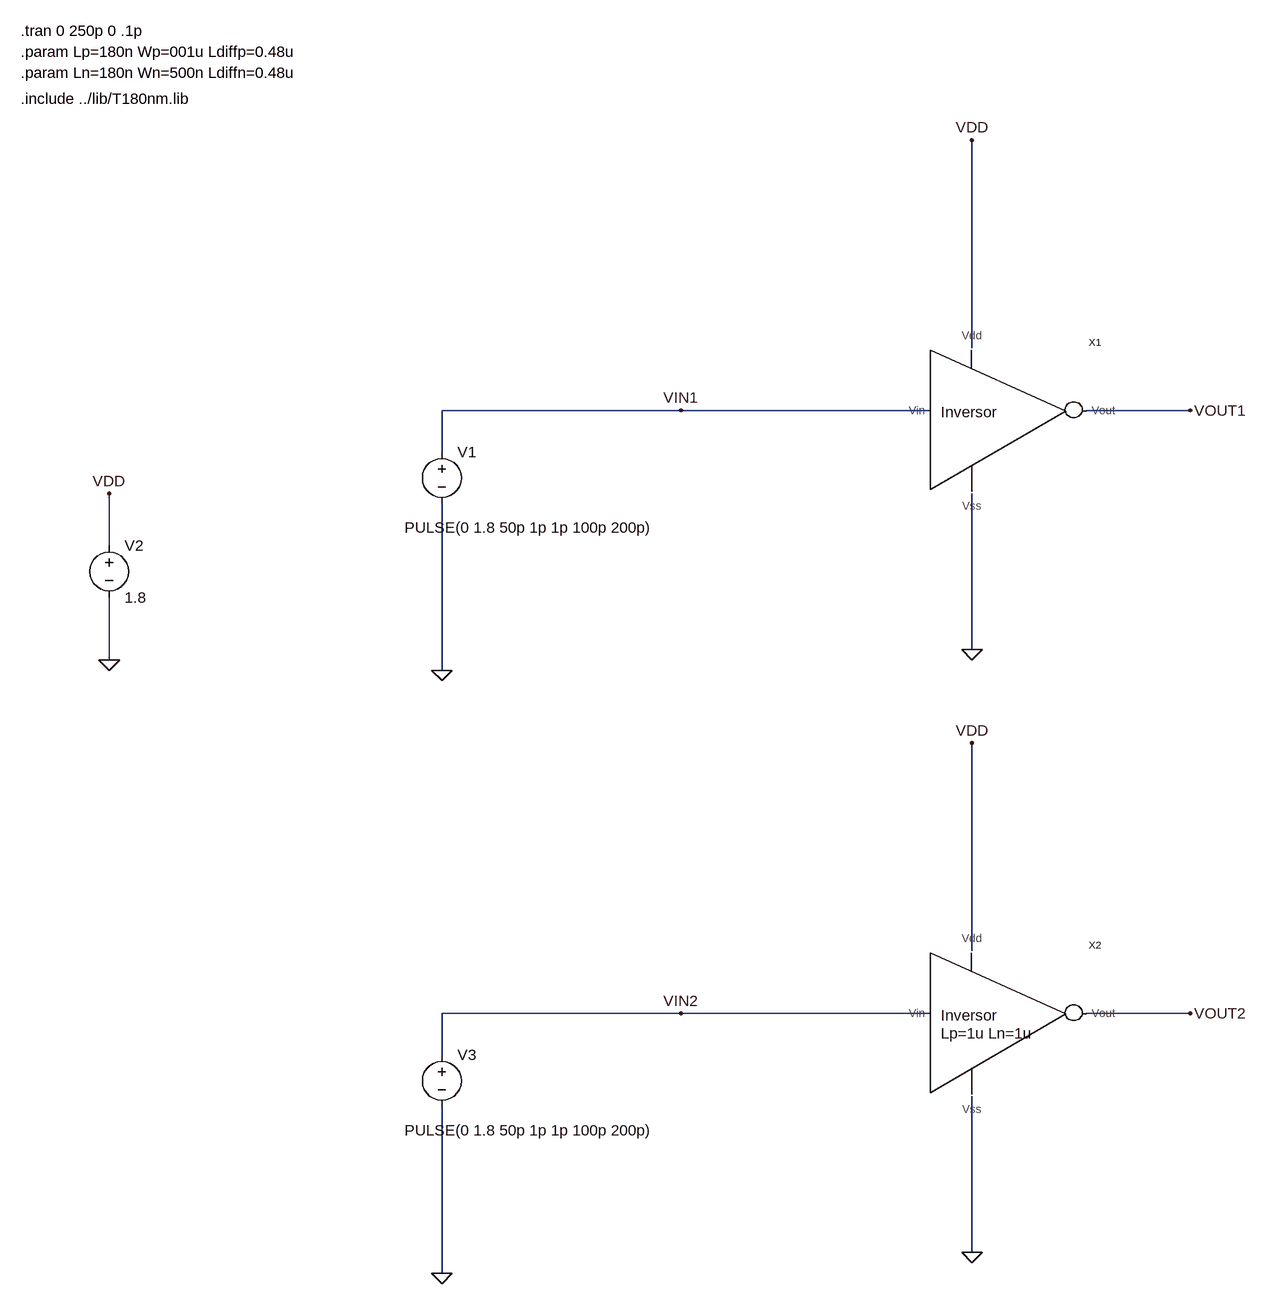
[diagram p0: schematic inversor_tb.asc]
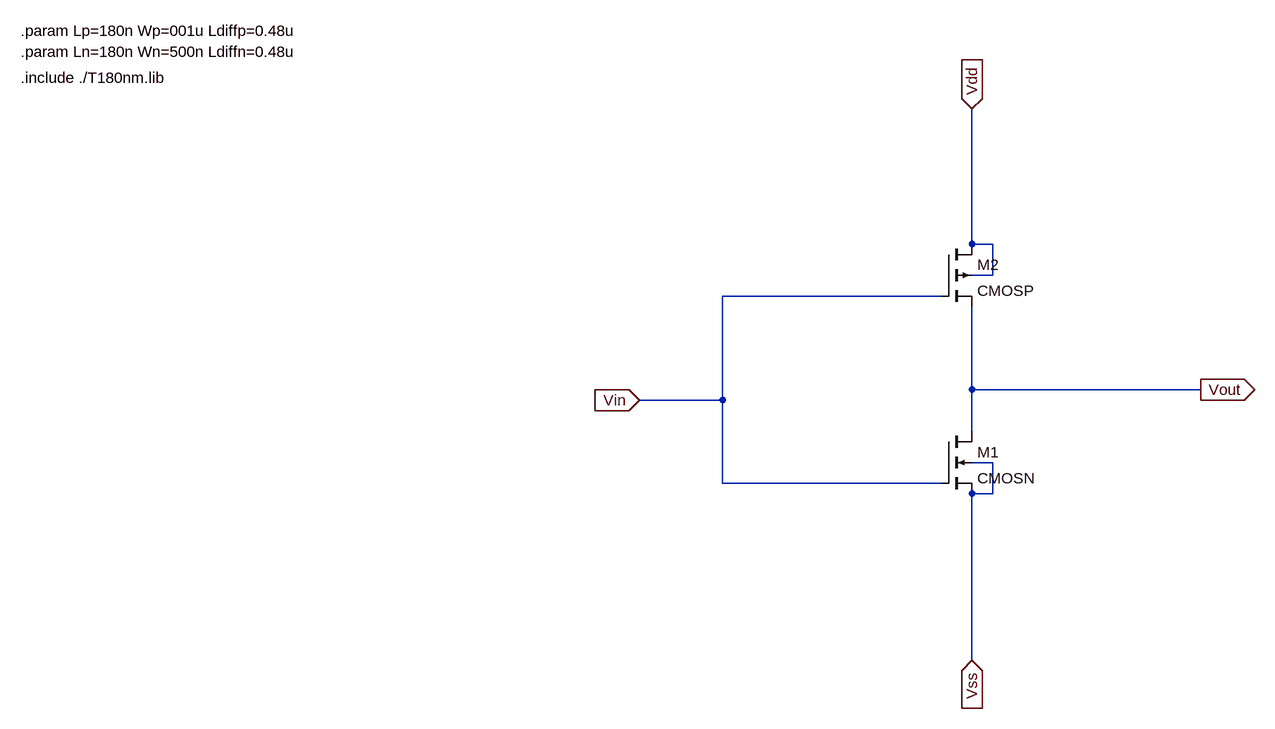
[diagram p1: sub-circuit inversor.asc]
inversor_tb.asc, the LTspice schematic file:
Version 4
SHEET 1 880 1476
WIRE 224 32 224 -288
WIRE -224 128 -592 128
WIRE 160 128 -224 128
WIRE 560 128 400 128
WIRE -592 192 -592 128
WIRE -1104 336 -1104 256
WIRE 224 496 224 256
WIRE -1104 512 -1104 416
WIRE -592 528 -592 272
WIRE 224 960 224 640
WIRE -224 1056 -592 1056
WIRE 160 1056 -224 1056
WIRE 560 1056 400 1056
WIRE -592 1120 -592 1056
WIRE 224 1424 224 1184
WIRE -592 1456 -592 1200
FLAG 224 496 0
FLAG 224 -288 VDD
FLAG 560 128 VOUT1
FLAG -224 128 VIN1
FLAG -1104 512 0
FLAG -592 528 0
FLAG -1104 256 VDD
FLAG 224 1424 0
FLAG 224 640 VDD
FLAG 560 1056 VOUT2
FLAG -224 1056 VIN2
FLAG -592 1456 0
SYMBOL voltage -592 176 R0
WINDOW 3 -57 132 Left 2
WINDOW 123 0 0 Left 2
WINDOW 39 0 0 Left 2
SYMATTR Value PULSE(0 1.8 50p 1p 1p 100p 200p)
SYMATTR InstName V1
SYMBOL voltage -1104 320 R0
WINDOW 123 0 0 Left 2
WINDOW 39 0 0 Left 2
SYMATTR InstName V2
SYMATTR Value 1.8
SYMBOL inversor 224 128 R0
SYMATTR InstName X1
SYMBOL voltage -592 1104 R0
WINDOW 3 -57 132 Left 2
WINDOW 123 0 0 Left 2
WINDOW 39 0 0 Left 2
SYMATTR Value PULSE(0 1.8 50p 1p 1p 100p 200p)
SYMATTR InstName V3
SYMBOL inversor 224 1056 R0
WINDOW 39 -48 31 Left 2
SYMATTR InstName X2
SYMATTR SpiceLine Lp=1u Ln=1u
TEXT -1240 -352 Left 2 !.include ../lib/T180nm.lib
TEXT -1240 -456 Left 2 !.tran 0 250p 0 .1p
TEXT -1240 -424 Left 2 !.param Lp=180n Wp=001u Ldiffp=0.48u
TEXT -1240 -392 Left 2 !.param Ln=180n Wn=500n Ldiffn=0.48u

inversor.asc, the sub-circuit schematic file:
Version 4
SHEET 1 880 712
WIRE 224 -96 224 -304
WIRE 256 -96 224 -96
WIRE 256 -48 256 -96
WIRE 256 -48 224 -48
WIRE 176 -16 -160 -16
WIRE 224 128 224 0
WIRE 576 128 224 128
WIRE -160 144 -160 -16
WIRE -160 144 -288 144
WIRE 224 192 224 128
WIRE 256 240 224 240
WIRE -160 272 -160 144
WIRE 176 272 -160 272
WIRE 256 288 256 240
WIRE 256 288 224 288
WIRE 224 544 224 288
FLAG -288 144 Vin
IOPIN -288 144 In
FLAG 576 128 Vout
IOPIN 576 128 Out
FLAG 224 -304 Vdd
IOPIN 224 -304 In
FLAG 224 544 Vss
IOPIN 224 544 In
SYMBOL nmos4 176 192 R0
SYMATTR InstName M1
SYMATTR Value CMOSN
SYMATTR Value2 l={Ln} w={Wn} ad={Ldiffn*Wn} as={Ldiffn*Wn} pd={2*Ldiffn+Wn} ps={2*Ldiffn+Wn}
SYMBOL pmos4 176 -96 R0
SYMATTR InstName M2
SYMATTR Value CMOSP
SYMATTR Value2 l={Lp} w={Wp} ad={Ldiffp*Wp} as={Ldiffp*Wp} pd={2*Ldiffp+Wp} ps={2*Ldiffp+Wp}
TEXT -1240 -352 Left 2 !.include ./T180nm.lib
TEXT -1240 -424 Left 2 !.param Lp=180n Wp=001u Ldiffp=0.48u
TEXT -1240 -392 Left 2 !.param Ln=180n Wn=500n Ldiffn=0.48u

The netlist it stands for:
* inversor_tb.asc
V1 VIN1 0 PULSE(0 1.8 50p 1p 1p 100p 200p)
V2 VDD 0 1.8
XX1 VIN1 VDD 0 VOUT1 inversor
V3 VIN2 0 PULSE(0 1.8 50p 1p 1p 100p 200p)
XX2 VIN2 VDD 0 VOUT2 inversor params: Lp=1u Ln=1u

* block symbol definitions
.subckt inversor Vin Vdd Vss Vout
M1 Vout Vin Vss Vss CMOSN l={Ln} w={Wn} ad={Ldiffn*Wn} as={Ldiffn*Wn} pd={2*Ldiffn+Wn} ps={2*Ldiffn+Wn}
M2 Vdd Vin Vout Vdd CMOSP l={Lp} w={Wp} ad={Ldiffp*Wp} as={Ldiffp*Wp} pd={2*Ldiffp+Wp} ps={2*Ldiffp+Wp}
.include ./T180nm.lib
.param Lp=180n Wp=001u Ldiffp=0.48u
.param Ln=180n Wn=500n Ldiffn=0.48u
.ends inversor

.model NMOS NMOS
.model PMOS PMOS
.lib standard.mos
.include ../lib/T180nm.lib
.tran 0 250p 0 .1p
.param Lp=180n Wp=001u Ldiffp=0.48u
.param Ln=180n Wn=500n Ldiffn=0.48u
.backanno
.end